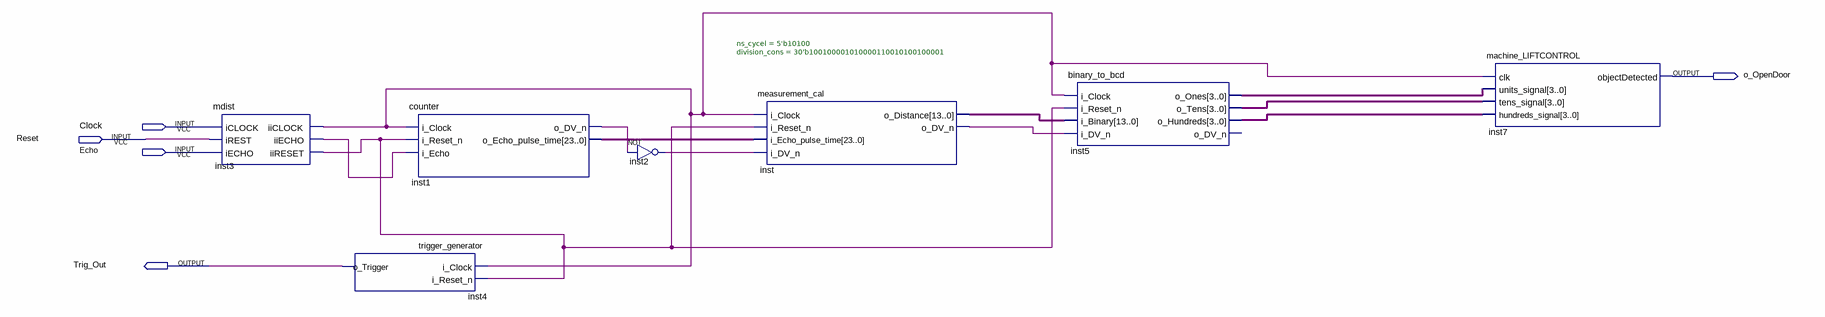
[diagram p0: schematic sheet]
// Quartus schematic ultrason.bdf as structural Verilog: 7 symbols, 5 pins
module ultrason (
  input  Clock,
  input  Reset,
  input  Echo,
  output o_OpenDoor,
  output Trig_Out
);

  wire inst1_o_dv_n, inst2_out, inst3_iiclock, inst3_iiecho, inst3_iireset, inst_o_dv_n;
  wire [3:0] inst5_o_hundreds, inst5_o_ones, inst5_o_tens;
  wire [13:0] inst_o_distance;
  wire [23:0] inst1_o_echo_pulse_time;

  mdist inst3 (
    .iCLOCK(Clock), .iREST(Reset), .iECHO(Echo), .iiCLOCK(inst3_iiclock), .iiECHO(inst3_iiecho),
    .iiRESET(inst3_iireset));
  trigger_generator inst4 (.i_Clock(inst3_iiclock), .i_Reset_n(inst3_iireset), .o_Trigger(Trig_Out));
  counter inst1 (
    .i_Clock(inst3_iiclock), .i_Reset_n(inst3_iireset), .i_Echo(inst3_iiecho), .o_DV_n(inst1_o_dv_n),
    .o_Echo_pulse_time(inst1_o_echo_pulse_time));
  not inst2 (inst2_out, inst1_o_dv_n);
  measurement_cal #(.ns_cycel(5'b10100), .division_cons(30'b100100001010000110010100100001)) inst (
    .i_Clock(inst3_iiclock), .i_Reset_n(inst3_iireset), .i_Echo_pulse_time(inst1_o_echo_pulse_time),
    .i_DV_n(inst2_out), .o_Distance(inst_o_distance), .o_DV_n(inst_o_dv_n));
  binary_to_bcd inst5 (
    .i_Clock(inst3_iiclock), .i_Reset_n(inst3_iireset), .i_Binary(inst_o_distance), .i_DV_n(inst_o_dv_n),
    .o_Ones(inst5_o_ones), .o_Tens(inst5_o_tens), .o_Hundreds(inst5_o_hundreds));  // open: o_DV_n
  machine_LIFTCONTROL inst7 (
    .clk(inst3_iiclock), .units_signal(inst5_o_ones), .tens_signal(inst5_o_tens),
    .hundreds_signal(inst5_o_hundreds), .objectDetected(o_OpenDoor));
endmodule
